# EAGLE design v2 (EAGLE 8.4.2)
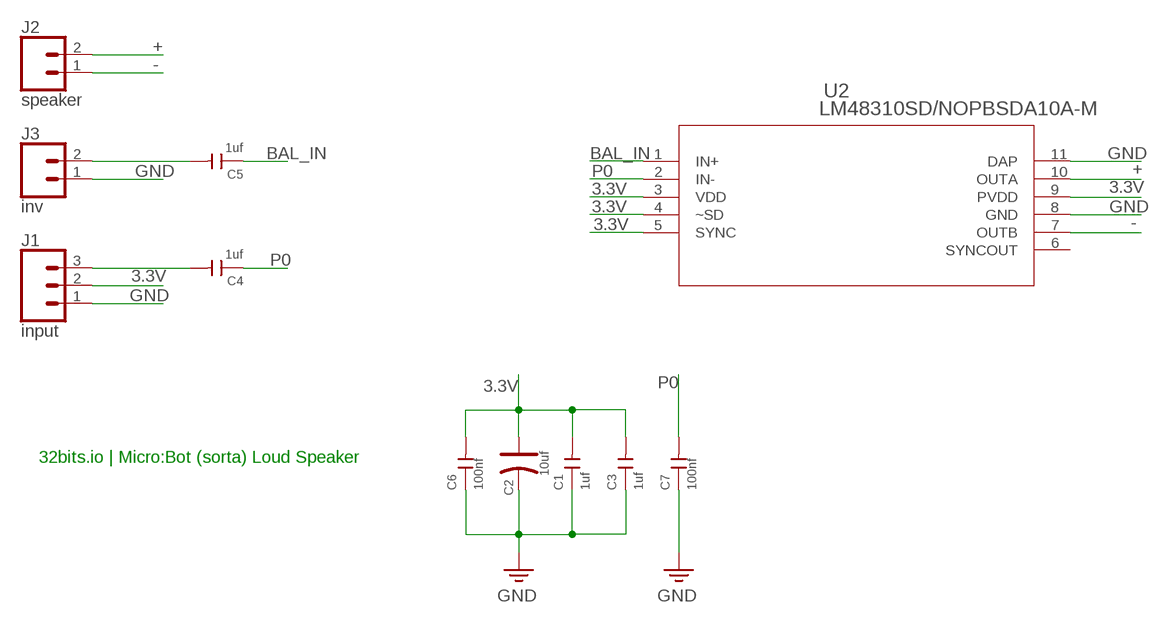
[diagram p0: schematic, sheet 1]

## Parts
C1  1uf  CERAMIC-1UF-25V-10%-X7R(0603)  [C0603]
C2  10uf  DIP-ALUMINUM-47UF-16V(D5-H7MM)  [PC-D5.3MM]
C3  1uf  CERAMIC-1UF-25V-10%-X7R(0603)  [C0603]
C4  1uf  CERAMIC-1UF-25V-10%-X7R(0603)  [C0603]
C5  1uf  CERAMIC-1UF-25V-10%-X7R(0603)  [C0603]
C6  100nf  CERAMIC-100NF-50V-10%-X7R(0603)  [C0603]
C7  100nf  CERAMIC-100NF-50V-10%-X7R(0603)  [C0603]
J1  input  CONN_03SMD_RA_MALE  [1X03_SMD_RA_MALE]
J2  speaker  CONN_02  [1X02]
J3  inv  CONN_02  [1X02]
U2  LM48310SD/NOPBSDA10A-M  [SDA10A-M]

## Nets
3.3V: C1.2 C2.+ C3.2 C6.2 J1.2 U2.3(VDD) U2.4(~SD) U2.5(SYNC) U2.9(PVDD)
+: J2.2 U2.10(OUTA)
-: J2.1 U2.7(OUTB)
BAL_IN: C5.1 U2.1(IN+)
BAL_IN_RAW: C5.2 J3.2
GND: C1.1 C2.- C3.1 C6.1 C7.1 J1.1 J3.1 U2.8(GND) U2.11(DAP)
P0: C4.1 C7.2 U2.2(IN-)
P0_RAW: C4.2 J1.3
Unconnected: U2.6(SYNCOUT)

## Notes on the sheet
- 32bits.io | Micro:Bot (sorta) Loud Speaker

## Library data of the parts
C1 C3-C5 = Seeed-Capacitor:CERAMIC-1UF-25V-10%-X7R(0603): 302010139; MPN: CC0603KRX7R8BB105
C2 = Seeed-Capacitor:DIP-ALUMINUM-47UF-16V(D5-H7MM): 302030033; MPN: KS 100uF/16V; VALUE: 100uf
C6 C7 = Seeed-Capacitor:CERAMIC-100NF-50V-10%-X7R(0603): 302010138; MPN: CC0603KRX7R9BB104
J1 = SparkFun-Connectors:CONN_03: Multi connection point. Often used as Generic Header-pin footprint for 0.1 inch spaced/style header connections On any of the 0.1 inch spaced packages, you can populate with these: Break Away Headers - Straight <https://www.sparkfun.com/products/116> (PRT-00116) Break Away Male Headers - Right Angle <https://www.sparkfun.com/products/553> (PRT-00553) Female Headers <https://www.sparkfun.com/products/115> (PRT-00115) Break Away Headers - Machine Pin <https://www.sparkfun.com/products/117> (PRT-00117) Break Away Female Headers - Swiss Machine Pin <https://www.sparkfun.com/products/743> (PRT-00743) Stackable Header - 3 Pin (Female, 0.1") <https://www.sparkfun.com/products/13875> (PRT-13875) For SCREWTERMINALS and SPRING TERMINALS visit here: Screw Terimnals on SparkFun.com <https://www.sparkfun.com/search/results?term=Screw+Terminals> (5mm/3.5mm/2.54mm spacing) This device is also useful as a general connection point to wire up your design to another part of your project. Our various solder wires solder well into these plated through hole pads. Hook-Up Wire - Assortment (Stranded, 22 AWG) <https://www.sparkfun.com/products/11375> (PRT-11375) Hook-Up Wire - Assortment (Solid Core, 22 AWG) <https://www.sparkfun.com/products/11367> (PRT-11367) View the entire wire category on our website here <https://www.sparkfun.com/categories/141> Special notes: Molex polarized connector foot print use with SKU : PRT-08232 with associated crimp pins and housings.; PROD_ID: CONN-10925
J2 J3 = SparkFun-Connectors:CONN_02: Multi connection point. Often used as Generic Header-pin footprint for 0.1 inch spaced/style header connections On any of the 0.1 inch spaced packages, you can populate with these: Break Away Headers - Straight <https://www.sparkfun.com/products/116> (PRT-00116) Break Away Male Headers - Right Angle <https://www.sparkfun.com/products/553> (PRT-00553) Female Headers <https://www.sparkfun.com/products/115> (PRT-00115) Break Away Headers - Machine Pin <https://www.sparkfun.com/products/117> (PRT-00117) Break Away Female Headers - Swiss Machine Pin <https://www.sparkfun.com/products/743> (PRT-00743) For SCREWTERMINALS and SPRING TERMINALS visit here: Screw Terimnals on SparkFun.com <https://www.sparkfun.com/search/results?term=Screw+Terminals> (5mm/3.5mm/2.54mm spacing) This device is also useful as a general connection point to wire up your design to another part of your project. Our various solder wires solder well into these plated through hole pads. Hook-Up Wire - Assortment (Stranded, 22 AWG) <https://www.sparkfun.com/products/11375> (PRT-11375) Hook-Up Wire - Assortment (Solid Core, 22 AWG) <https://www.sparkfun.com/products/11367> (PRT-11367) View the entire wire category on our website here <https://www.sparkfun.com/categories/141> Special notes: Molex polarized connector foot print use with: PRT-08233 with associated crimp pins and housings. 2.54_SCREWTERM for use with PRT-10571. 3.5mm Screw Terminal footprints for PRT-08084 5mm Screw Terminal footprints for use with PRT-08432
U2 = BuzzerLib:LM48310SD/NOPB; MANUFACTURER_PART_NUMBER: LM48310SDNOPB; VENDOR: Texas Instruments

## Board
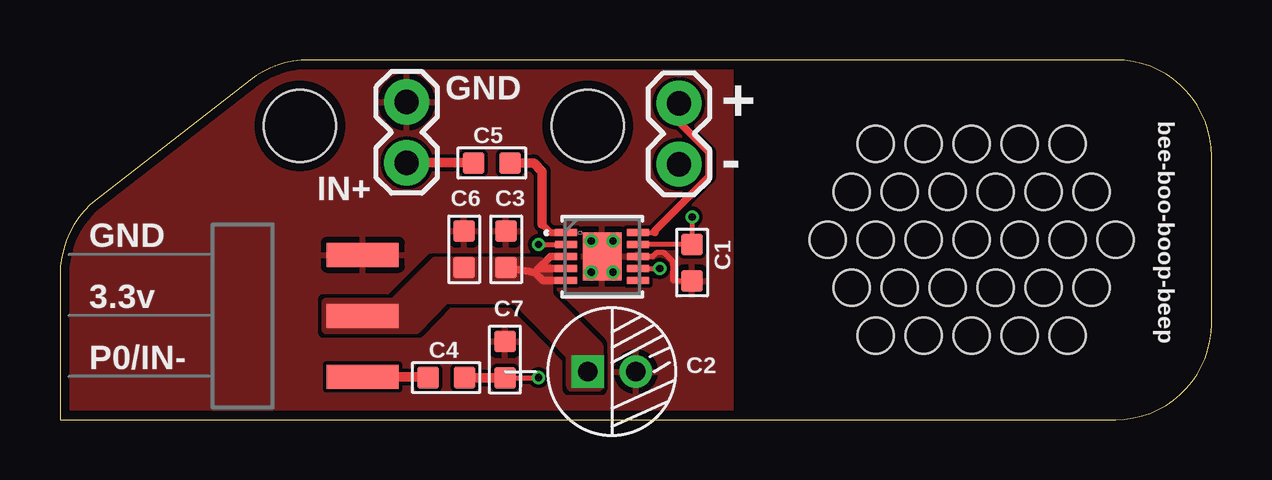
[diagram p1: board, top side]
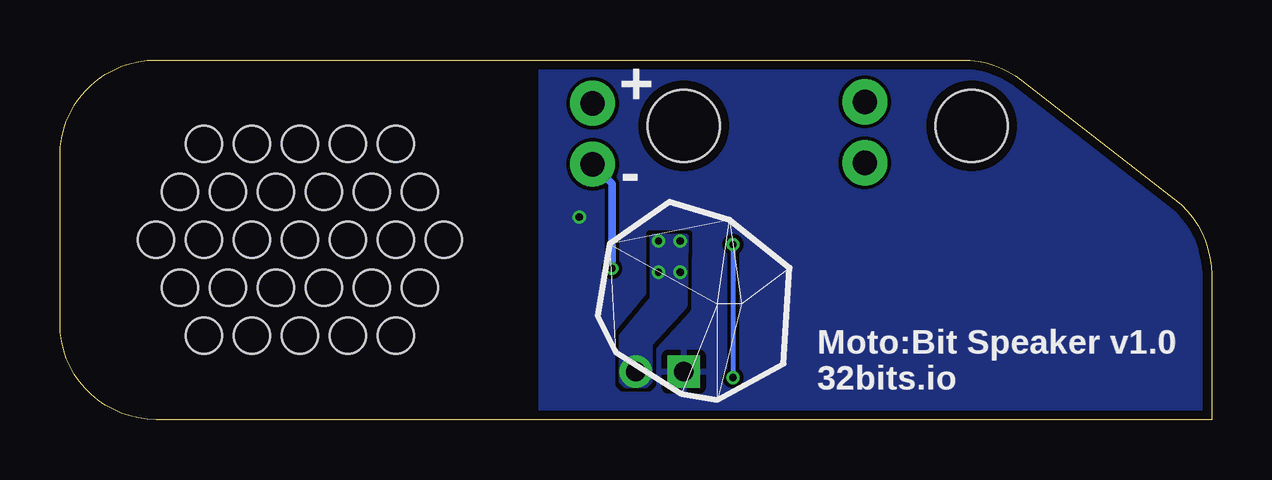
[diagram p2: board, bottom side, seen from below]

Size 48 x 15 mm. Coordinates in mm from the lower left corner, seen from the top.
Outline: 0,0 44,0 arc90 48,4 48,11 arc90 44,15 10.37,15 arc38 7.92,14.16 1.54,9.2 arc52 0,6.04 0,0
Copper layers (1*16): Top 0.035559375mm / dielectric 1.6mm / Bottom 0.035559375mm
Design rules "oshpark-2layer-tented": minimum track width 6mil, minimum drill 10mil, track to track 6mil, track to pad 6mil, pad to pad 6mil, via to via 6mil, smd to smd 6mil, copper to edge 15mil, drill to drill 6mil, minimum pad ring 5mil, minimum via ring 5mil, stop-mask expansion 2.5mil, vias tented up to drill 20mil, thermal gap 10mil
Holes 3 mm at 22,12.25 10,12.25
Holes 1.5 mm at 38,7.5 40,7.5 36,7.5 37,9.5 39,9.5 37,5.5 39,5.5 35,9.5 41,9.5 42,7.5 34,7.5 35,5.5 41,5.5 36,3.5 38,3.5 40,3.5 36,11.5 38,11.5 40,11.5 34,11.5 33,9.5 32,7.5 33,5.5 34,3.5 42,3.5 43,5.5 44,7.5 43,9.5 42,11.5

### Footprints (pad centres in the part's own frame; a part is rotated, then mirrored left to right if it is on the bottom)
C0603 = smd 0.889 x 0.889: 1 0,0.762; 2 0,-0.762
PC-D5.3MM = drill 0.8 pad 1.35 square: + -1,0 | drill 0.8 pad 1.35: - 1,0
1X03_SMD_RA_MALE = smd 1 x 3: 1 -2.54,5; 2 0,5; 3 2.54,5
1X02 = drill 1.016 pad 1.88: 1 0,0; 2 2.54,0
SDA10A-M = smd 0.914 x 0.305: 1 -1.499,1; 2 -1.499,0.5; 3 -1.499,0; 4 -1.499,-0.5; 5 -1.499,-1; 6 1.499,-1; 7 1.499,-0.5; 8 1.499,0; 9 1.499,0.5; 10 1.499,1 | smd 1.6 x 2: 11 0,0

### Placement (x,y rotation side)
C1  26.35,6.55 180 top
C2  23,2 0 top
C3  18.6,7.1 0 top
C4  16.1,1.75 270 top
C5  18,10.7 270 top
C6  16.85,7.1 0 top
C7  18.55,2.5 0 top
J1  7.62,4.33 270 top
J2  25.8,10.65 90 top
J3  14.45,13.25 270 top
U2  22.6,6.8 0 top
U$2  [32BITS_LOGO]  24.4,0.6 0 bottom

### Tracks (layer width: path | path; a pad name or v marks a point on that pad's centre or on a via)
3.3V  (via drill 0.3)
  Top 0.2: U2.9 24.11,7.31 C1.2 v26.35,8.45
  Top 0.305: 19.79,6.14 C3.2 | 19.95,6.3 20.45,6.8 U2.3 | U2.4 19.95,6.3 | 19.95,6.3 19.79,6.14 | U2.5 20.13,5.8 19.79,6.14
  pour Bottom (rank 2): -1,16 28,16 28,-1 -1,-1
  pour Top (no thermals): 15.65,6.55 20,6.55 20.3,6.3 20.3,5.15 22.4,3.05 22.4,1.4 21.35,1.4 21.35,2.7 19.05,5.05 16,5.05 14.8,3.8 11.15,3.8 11.15,4.85 13.95,4.85
+
  Top 0.2: U2.10 24.8,7.8
  Top 0.305: 24.8,7.8 24.8,7.89 27.05,10.13 27.05,11.17 25.8,12.41 J2.2
-  (via drill 0.3)
  Top 0.2: U2.7 v25,6.3
  Bottom 0.305: v25,6.3 25,9.85 J2.1
BAL_IN
  Top 0.3: 20.1,8.15 20.45,7.8 U2.1
  Top 0.4: C5.1 19.75,10.7 20.1,10.35 20.1,8.15
BAL_IN_RAW
  Top 0.4: J3.2 17.15,10.71
  Top 0.5: 17.15,10.71 C5.2
GND  (via drill 0.3)
  Top 0.2: C1.1 25.56,5.79 25.55,5.8 25.55,6.6 25.18,6.96 24.86,6.96 24.7,6.8 U2.8
  other vias: 23.05,7.45 22.15,7.45 22.15,6.15 23.05,6.15
  pour Top (rank 3): -1,16 28,16 28,-1 -1,-1
  pour Bottom (no thermals): 21.9,7.65 21.95,4.75 23.4,3.15 23.4,1.6 23.6,1.4 24.4,1.4 24.6,1.6 24.6,3.5 23.3,5.05 23.3,7.65
P0  (via drill 0.3)
  Top 0.2: v19.95,7.3 U2.2 | C7.2 19.94,1.74 v19.95,1.75
  Top 0.4: C4.1 18.54,1.75
  Top 0.5: 18.54,1.75 C7.2
  Bottom 0.2: v19.95,7.3 v19.95,1.75
P0_RAW
  Top 0.4: J1.3 15.3,1.79
  Top 0.5: 15.3,1.79 C4.2

### Text on the board
tPlace: GND | + | bee-boo-boop-beep | - | IN+ | GND | 3.3v | P0/IN-
bPlace: + | - | Moto:Bit Speaker v1.0 / 32bits.io